# EAGLE design untitled (EAGLE 7.2.0)
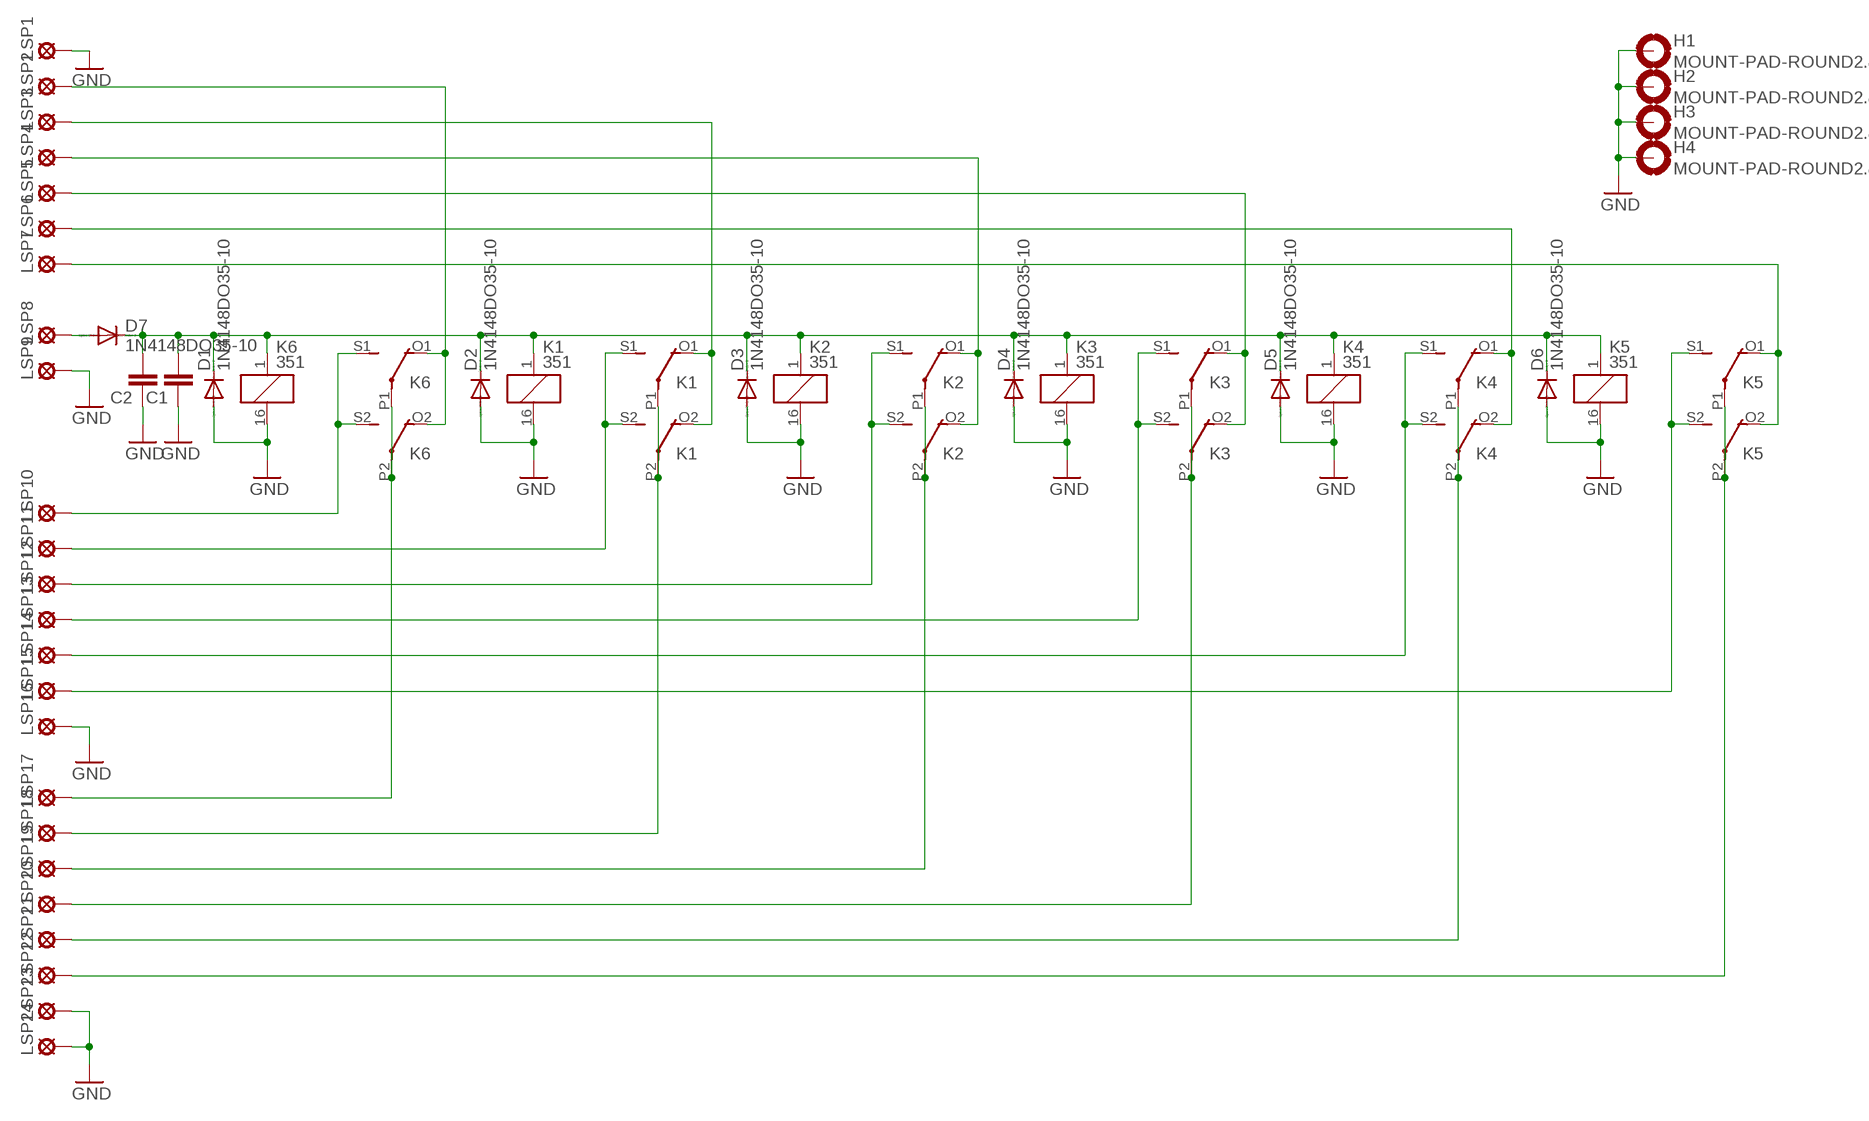
[diagram p0: schematic, sheet 1]

## Parts
C1  C-EU050-025X075  [C050-025X075]
C2  C-EU050-025X075  [C050-025X075]
D1  1N4148DO35-10  [DO35-10]
D2  1N4148DO35-10  [DO35-10]
D3  1N4148DO35-10  [DO35-10]
D4  1N4148DO35-10  [DO35-10]
D5  1N4148DO35-10  [DO35-10]
D6  1N4148DO35-10  [DO35-10]
D7  1N4148DO35-10  [DO35-10]
H1  MOUNT-PAD-ROUND2.8  [2,8-PAD]
H2  MOUNT-PAD-ROUND2.8  [2,8-PAD]
H3  MOUNT-PAD-ROUND2.8  [2,8-PAD]
H4  MOUNT-PAD-ROUND2.8  [2,8-PAD]
K1  351  [351]
K2  351  [351]
K3  351  [351]
K4  351  [351]
K5  351  [351]
K6  351  [351]
LSP1  SE14  [SE14]
LSP2  SE14  [SE14]
LSP3  SE14  [SE14]
LSP4  SE14  [SE14]
LSP5  SE14  [SE14]
LSP6  SE14  [SE14]
LSP7  SE14  [SE14]
LSP8  SE14  [SE14]
LSP9  SE14  [SE14]
LSP10  SE14  [SE14]
LSP11  SE14  [SE14]
LSP12  SE14  [SE14]
LSP13  SE14  [SE14]
LSP14  SE14  [SE14]
LSP15  SE14  [SE14]
LSP16  SE14  [SE14]
LSP17  SE14  [SE14]
LSP18  SE14  [SE14]
LSP19  SE14  [SE14]
LSP20  SE14  [SE14]
LSP21  SE14  [SE14]
LSP22  SE14  [SE14]
LSP23  SE14  [SE14]
LSP24  SE14  [SE14]

## Nets
GND: C1.1 C2.1 D1.A D2.A D3.A D4.A D5.A D6.A H1.B2,8(MOUNT) H2.B2,8(MOUNT) H3.B2,8(MOUNT) H4.B2,8(MOUNT) K2.16 K3.16 K4.16 K5.16 K6.16 LSP1.MP LSP9.MP LSP16.MP LSP23.MP LSP24.MP
GND1: K1.16
N$1: K6.O1(2:O) K6.O2(3:O) LSP2.MP
N$2: K6.S1(2:S) K6.S2(3:S) LSP10.MP
N$3: K1.O1(2:O) K1.O2(3:O) LSP3.MP
N$4: K1.S1(2:S) K1.S2(3:S) LSP11.MP
N$5: K2.O1(2:O) K2.O2(3:O) LSP4.MP
N$6: K2.S1(2:S) K2.S2(3:S) LSP12.MP
N$7: K3.O1(2:O) K3.O2(3:O) LSP5.MP
N$8: K3.S1(2:S) K3.S2(3:S) LSP13.MP
N$9: K4.O1(2:O) K4.O2(3:O) LSP6.MP
N$10: K4.S1(2:S) K4.S2(3:S) LSP14.MP
N$11: K5.O1(2:O) K5.O2(3:O) LSP7.MP
N$12: K5.S1(2:S) K5.S2(3:S) LSP15.MP
N$13: K6.P1(2:P) K6.P2(3:P) LSP17.MP
N$14: K1.P1(2:P) K1.P2(3:P) LSP18.MP
N$15: K2.P1(2:P) K2.P2(3:P) LSP19.MP
N$16: C1.2 C2.2 D1.C D2.C D3.C D4.C D5.C D6.C D7.C K1.1 K2.1 K3.1 K4.1 K5.1 K6.1
N$17: K3.P1(2:P) K3.P2(3:P) LSP20.MP
N$18: K4.P1(2:P) K4.P2(3:P) LSP21.MP
N$19: K5.P1(2:P) K5.P2(3:P) LSP22.MP
N$20: D7.A LSP8.MP

## Library data of the parts
C1 C2 = rcl:C-EU: CAPACITOR, European symbol
D1-D7 = diode:1N4148: DIODE high speed (Philips)
H1-H4 = holes:MOUNT-PAD-ROUND: MOUNTING PAD, round
K1-K6 = relay:351: RELAY 2 x switch, Omron; OC_FARNELL: unknown; OC_NEWARK: unknown
LSP1-LSP24 = solpad:SE14: SOLDER PAD E1553, drill 1,4mm, distributor Buerklin, 07F820

## Board
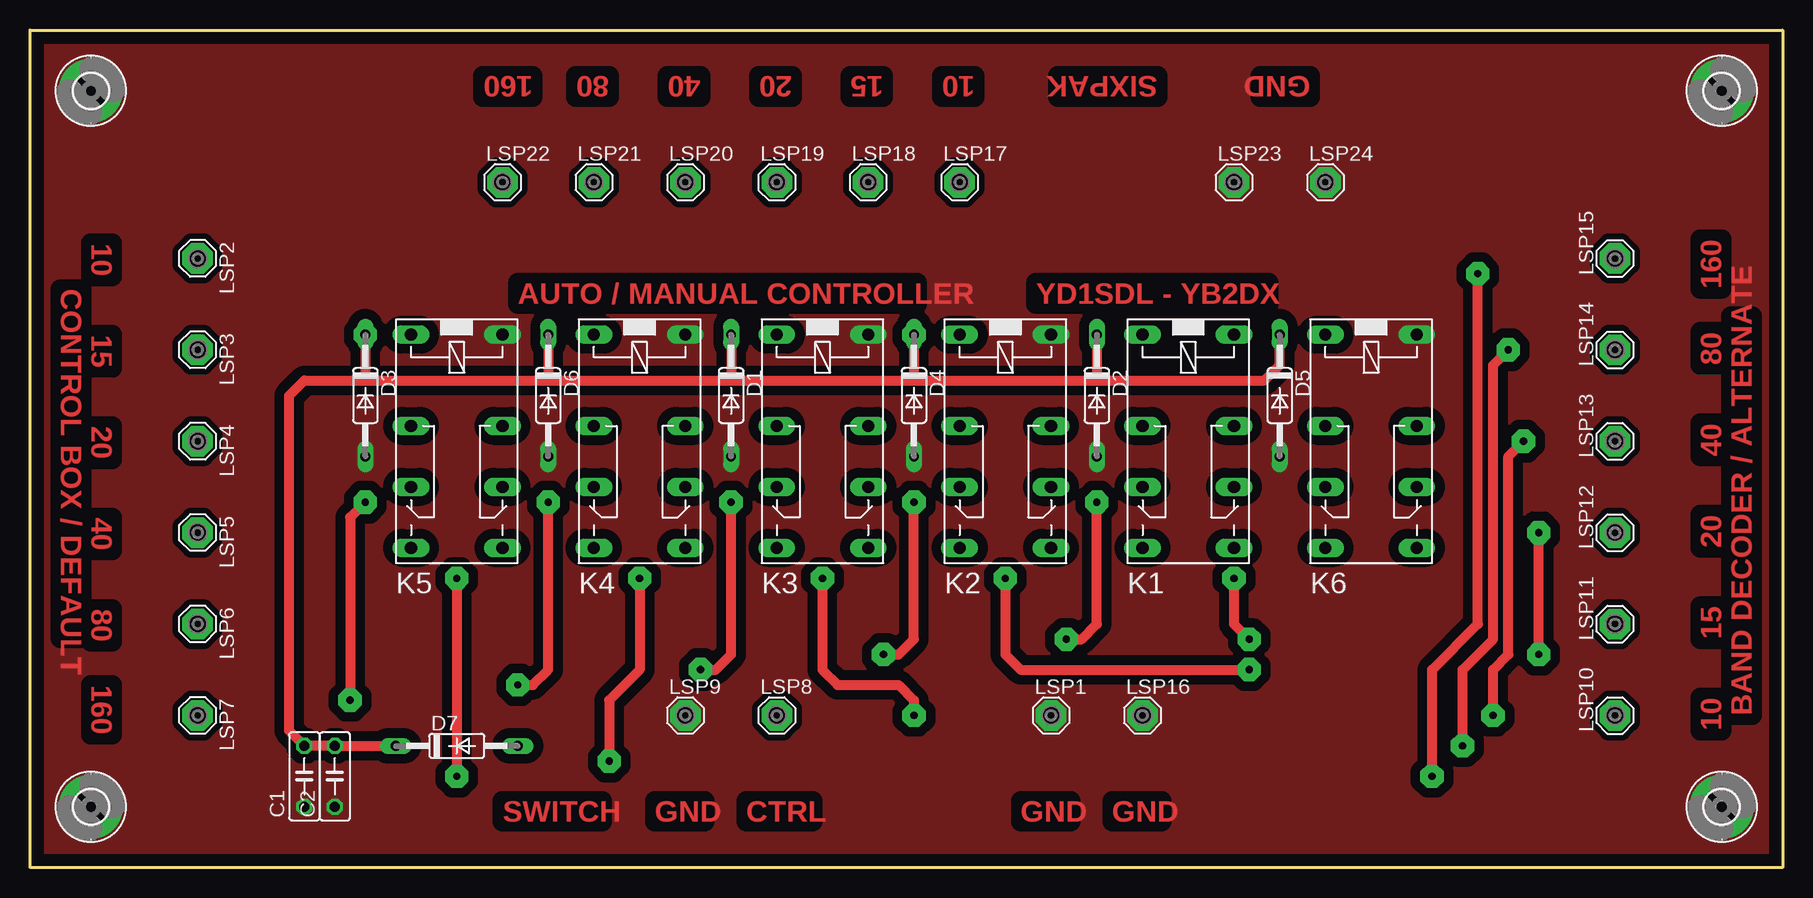
[diagram p1: board, top side]
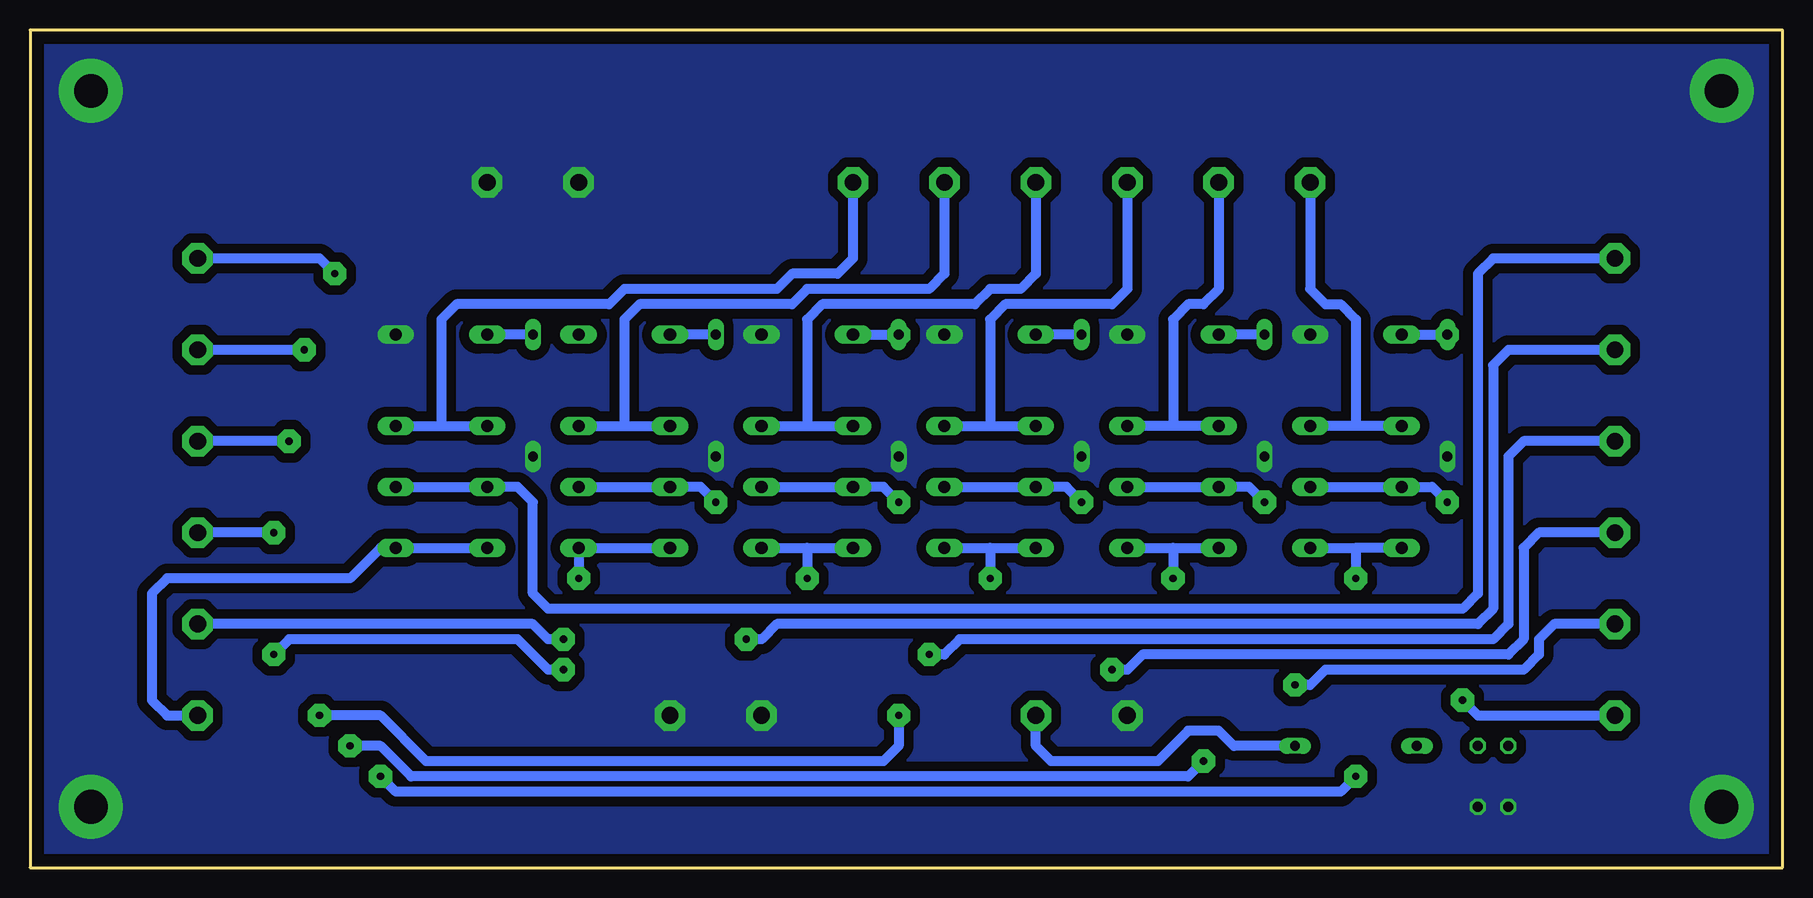
[diagram p2: board, bottom side, seen from below]

Size 146.05 x 69.85 mm. Coordinates in mm from the lower left corner, seen from the top.
Outline: 0,69.85 146.05,69.85 146.05,0 0,0 0,69.85
Copper layers (1*16): Top 0.035mm / dielectric 1.5mm / Bottom 0.035mm
Design rules "default": minimum track width 10mil, minimum drill 24mil, track to track 8mil, track to pad 8mil, pad to pad 8mil, via to via 8mil, smd to smd 8mil, copper to edge 40mil, drill to drill 8mil, minimum pad ring 10mil, minimum via ring 8mil, stop-mask expansion 4mil, vias tented up to drill 0mil, thermal gap 10mil

### Footprints (pad centres in the part's own frame; a part is rotated, then mirrored left to right if it is on the bottom)
C050-025X075 = drill 0.813 octagon: 1 -2.54,0; 2 2.54,0
DO35-10 = drill 0.813 long: A 5.08,0; C -5.08,0
2,8-PAD = drill 2.8 pad 5.334: B2,8 0,0
351 = drill 1.016 long: 1 -3.81,-3.81; 16 -3.81,3.81; O1 8.89,-3.81; O2 8.89,3.81; P1 3.81,-3.81; P2 3.81,3.81; S1 13.97,-3.81; S2 13.97,3.81
SE14 = drill 1.397 pad 2.54 octagon: MP 0,0

### Placement (x,y rotation side)
C1  22.86,7.62 90 top
C2  25.4,7.62 90 top
D1  58.42,39.37 270 top
D2  88.9,39.37 270 top
D3  27.94,39.37 270 top
D4  73.66,39.37 270 top
D5  104.14,39.37 270 top
D6  43.18,39.37 270 top
D7  35.56,10.16 0 top
H1  5.08,5.08 0 top
H2  140.97,5.08 0 top
H3  140.97,64.77 0 top
H4  5.08,64.77 0 top
K1  96.52,40.64 270 top
K2  81.28,40.64 270 top
K3  66.04,40.64 270 top
K4  50.8,40.64 270 top
K5  35.56,40.64 270 top
K6  111.76,40.64 270 top
LSP1  85.09,12.7 0 top
LSP2  13.97,50.8 270 top
LSP3  13.97,43.18 270 top
LSP4  13.97,35.56 270 top
LSP5  13.97,27.94 270 top
LSP6  13.97,20.32 270 top
LSP7  13.97,12.7 270 top
LSP8  62.23,12.7 0 top
LSP9  54.61,12.7 0 top
LSP10  132.08,12.7 90 top
LSP11  132.08,20.32 90 top
LSP12  132.08,27.94 90 top
LSP13  132.08,35.56 90 top
LSP14  132.08,43.18 90 top
LSP15  132.08,50.8 90 top
LSP16  92.71,12.7 0 top
LSP17  77.47,57.15 0 top
LSP18  69.85,57.15 0 top
LSP19  62.23,57.15 0 top
LSP20  54.61,57.15 0 top
LSP21  46.99,57.15 0 top
LSP22  39.37,57.15 0 top
LSP23  100.33,57.15 0 top
LSP24  107.95,57.15 0 top

### Tracks (layer width: path | path; a pad name or v marks a point on that pad's centre or on a via)
GND
  pour Top (isolate 0.813, no thermals): 0,69.85 146.05,69.85 146.05,0 0,0
  pour Bottom (isolate 0.813, no thermals): 0,69.85 146.05,69.85 146.05,0 0,0
N$1
  Bottom 0.813: K6.O2 K6.O1 105.41,31.75 104.14,30.48 104.14,22.86 102.87,21.59 26.67,21.59 25.4,22.86 25.4,49.53 24.13,50.8 LSP2.MP
N$2
  Bottom 0.813: K6.S1 K6.S2 116.84,26.67 119.38,24.13 134.62,24.13 135.89,22.86 135.89,13.97 134.62,12.7 LSP10.MP
N$3  (via drill 0.6 pad 1.93)
  Top 0.813: v86.36,19.05 87.63,19.05 88.9,20.32 v88.9,30.48
  Bottom 0.813: K1.O2 K1.O1 90.17,31.75 v88.9,30.48 | LSP3.MP 22.86,43.18 24.13,41.91 24.13,21.59 25.4,20.32 83.82,20.32 85.09,19.05 v86.36,19.05
N$4  (via drill 0.6 pad 1.93)
  Top 0.813: v100.33,24.13 100.33,20.32 v101.6,19.05
  Bottom 0.813: K1.S1 K1.S2 v100.33,24.13 | v101.6,19.05 102.87,19.05 104.14,20.32 LSP11.MP
N$5  (via drill 0.6 pad 1.93)
  Top 0.813: v71.12,17.78 72.39,17.78 73.66,19.05 v73.66,30.48
  Bottom 0.813: K2.O2 K2.O1 74.93,31.75 v73.66,30.48 | LSP4.MP 21.59,35.56 22.86,34.29 22.86,20.32 24.13,19.05 68.58,19.05 69.85,17.78 v71.12,17.78
N$6  (via drill 0.6 pad 1.93)
  Top 0.813: v81.28,24.13 81.28,17.78 82.55,16.51 v101.6,16.51 | v125.73,17.78 v125.73,27.94
  Bottom 0.813: 81.28,26.67 K2.S1 | K2.S2 81.28,26.67 | 81.28,26.67 v81.28,24.13 | v101.6,16.51 102.87,16.51 105.41,19.05 124.46,19.05 v125.73,17.78 | v125.73,27.94 LSP12.MP
N$7  (via drill 0.6 pad 1.93)
  Top 0.813: v55.88,16.51 57.15,16.51 58.42,17.78 v58.42,30.48
  Bottom 0.813: K3.O2 K3.O1 59.69,31.75 v58.42,30.48 | LSP5.MP 20.32,27.94 21.59,26.67 21.59,19.05 22.86,17.78 53.34,17.78 54.61,16.51 v55.88,16.51
N$8  (via drill 0.6 pad 1.93)
  Top 0.813: v66.04,24.13 66.04,16.51 67.31,15.24 72.39,15.24 73.66,13.97 v73.66,12.7 | v121.92,12.7 121.92,16.51 123.19,17.78 123.19,34.29 v124.46,35.56
  Bottom 0.813: 66.04,26.67 K3.S1 | K3.S2 66.04,26.67 | 66.04,26.67 v66.04,24.13 | v73.66,12.7 73.66,10.16 74.93,8.89 113.03,8.89 116.84,12.7 v121.92,12.7 | v124.46,35.56 LSP13.MP
N$9  (via drill 0.6 pad 1.93)
  Top 0.813: v40.64,15.24 41.91,15.24 43.18,16.51 v43.18,30.48
  Bottom 0.813: K4.O2 K4.O1 44.45,31.75 v43.18,30.48 | LSP6.MP 19.05,20.32 20.32,19.05 20.32,17.78 21.59,16.51 38.1,16.51 39.37,15.24 v40.64,15.24
N$10  (via drill 0.6 pad 1.93)
  Top 0.813: v50.8,24.13 50.8,16.51 48.26,13.97 v48.26,8.89 | v119.38,10.16 119.38,16.51 121.92,19.05 121.92,41.91 v123.19,43.18
  Bottom 0.813: 50.8,26.67 K4.S1 | K4.S2 50.8,26.67 | 50.8,26.67 v50.8,24.13 | v48.26,8.89 49.53,7.62 114.3,7.62 116.84,10.16 v119.38,10.16 | v123.19,43.18 LSP14.MP
N$11  (via drill 0.6 pad 1.93)
  Top 0.813: v27.94,30.48 26.67,29.21 v26.67,13.97
  Bottom 0.813: K5.O2 K5.O1 29.21,31.75 v27.94,30.48 | v26.67,13.97 25.4,12.7 LSP7.MP
N$12  (via drill 0.6 pad 1.93)
  Top 0.813: v35.56,24.13 v35.56,7.62 | v116.84,7.62 116.84,16.51 120.65,20.32 v120.65,49.53
  Bottom 0.813: K5.S1 35.56,26.67 | K5.S2 35.56,26.67 | 35.56,26.67 v35.56,24.13 | v35.56,7.62 36.83,6.35 115.57,6.35 v116.84,7.62 | v120.65,49.53 121.92,50.8 LSP15.MP
N$13
  Bottom 0.813: K6.P2 111.76,36.83 | 111.76,36.83 K6.P1 | LSP17.MP 77.47,50.8 78.74,49.53 82.55,49.53 83.82,48.26 96.52,48.26 97.79,46.99 110.49,46.99 111.76,45.72 111.76,36.83
N$14
  Bottom 0.813: K1.P2 96.52,36.83 | 96.52,36.83 K1.P1 | LSP18.MP 69.85,49.53 71.12,48.26 81.28,48.26 82.55,46.99 95.25,46.99 96.52,45.72 96.52,36.83
N$15
  Bottom 0.813: K2.P2 81.28,36.83 | 81.28,36.83 K2.P1 | LSP19.MP 62.23,49.53 63.5,48.26 66.04,48.26 67.31,46.99 80.01,46.99 81.28,45.72 81.28,36.83
N$16  (via drill 0.6 pad 1.93)
  Top 0.813: D3.C 27.94,40.64 | 27.94,40.64 43.18,40.64 | 43.18,40.64 58.42,40.64 | 58.42,40.64 73.66,40.64 | 73.66,40.64 88.9,40.64 | 88.9,40.64 102.87,40.64 104.14,41.91 D5.C | 27.94,40.64 22.86,40.64 21.59,39.37 21.59,11.43 C1.2 C2.2 D7.C | D6.C 43.18,40.64 | D1.C 58.42,40.64 | D2.C 88.9,40.64 | D4.C 73.66,40.64
  Bottom 0.813: D6.C K4.1 | D1.C K3.1 | D2.C K1.1 | D5.C K6.1 | K5.1 D3.C | K2.1 D4.C
  other vias: 27.94,44.45 73.66,44.45
N$17
  Bottom 0.813: K3.P2 66.04,36.83 | 66.04,36.83 K3.P1 | LSP20.MP 54.61,48.26 55.88,46.99 64.77,46.99 66.04,45.72 66.04,36.83
N$18
  Bottom 0.813: K4.P1 50.8,36.83 | 50.8,36.83 K4.P2 | LSP21.MP 46.99,48.26 48.26,46.99 49.53,46.99 50.8,45.72 50.8,36.83
N$19
  Bottom 0.813: K5.P1 35.56,36.83 | 35.56,36.83 K5.P2 | LSP22.MP 39.37,48.26 38.1,46.99 36.83,46.99 35.56,45.72 35.56,36.83
N$20
  Bottom 0.813: D7.A 45.72,10.16 46.99,11.43 49.53,11.43 52.07,8.89 60.96,8.89 62.23,10.16 LSP8.MP
(copper drawn outside any net)
  shapes: Top area x2

### Text on the board
Top: 160 | 80 | 40 | 20 | 15 | 10 | SIXPAK | GND | 10 | CONTROL BOX / DEFAULT | 160 | AUTO / MANUAL CONTROLLER | YD1SDL - YB2DX | 15 | 80 | 20 | 40 | 40 | 20 | 80 | 15 | 160 | BAND DECODER / ALTERNATE | 10 | SWITCH | GND | CTRL | GND | GND